# EAGLE schematic GateControl (EAGLE 6.4)
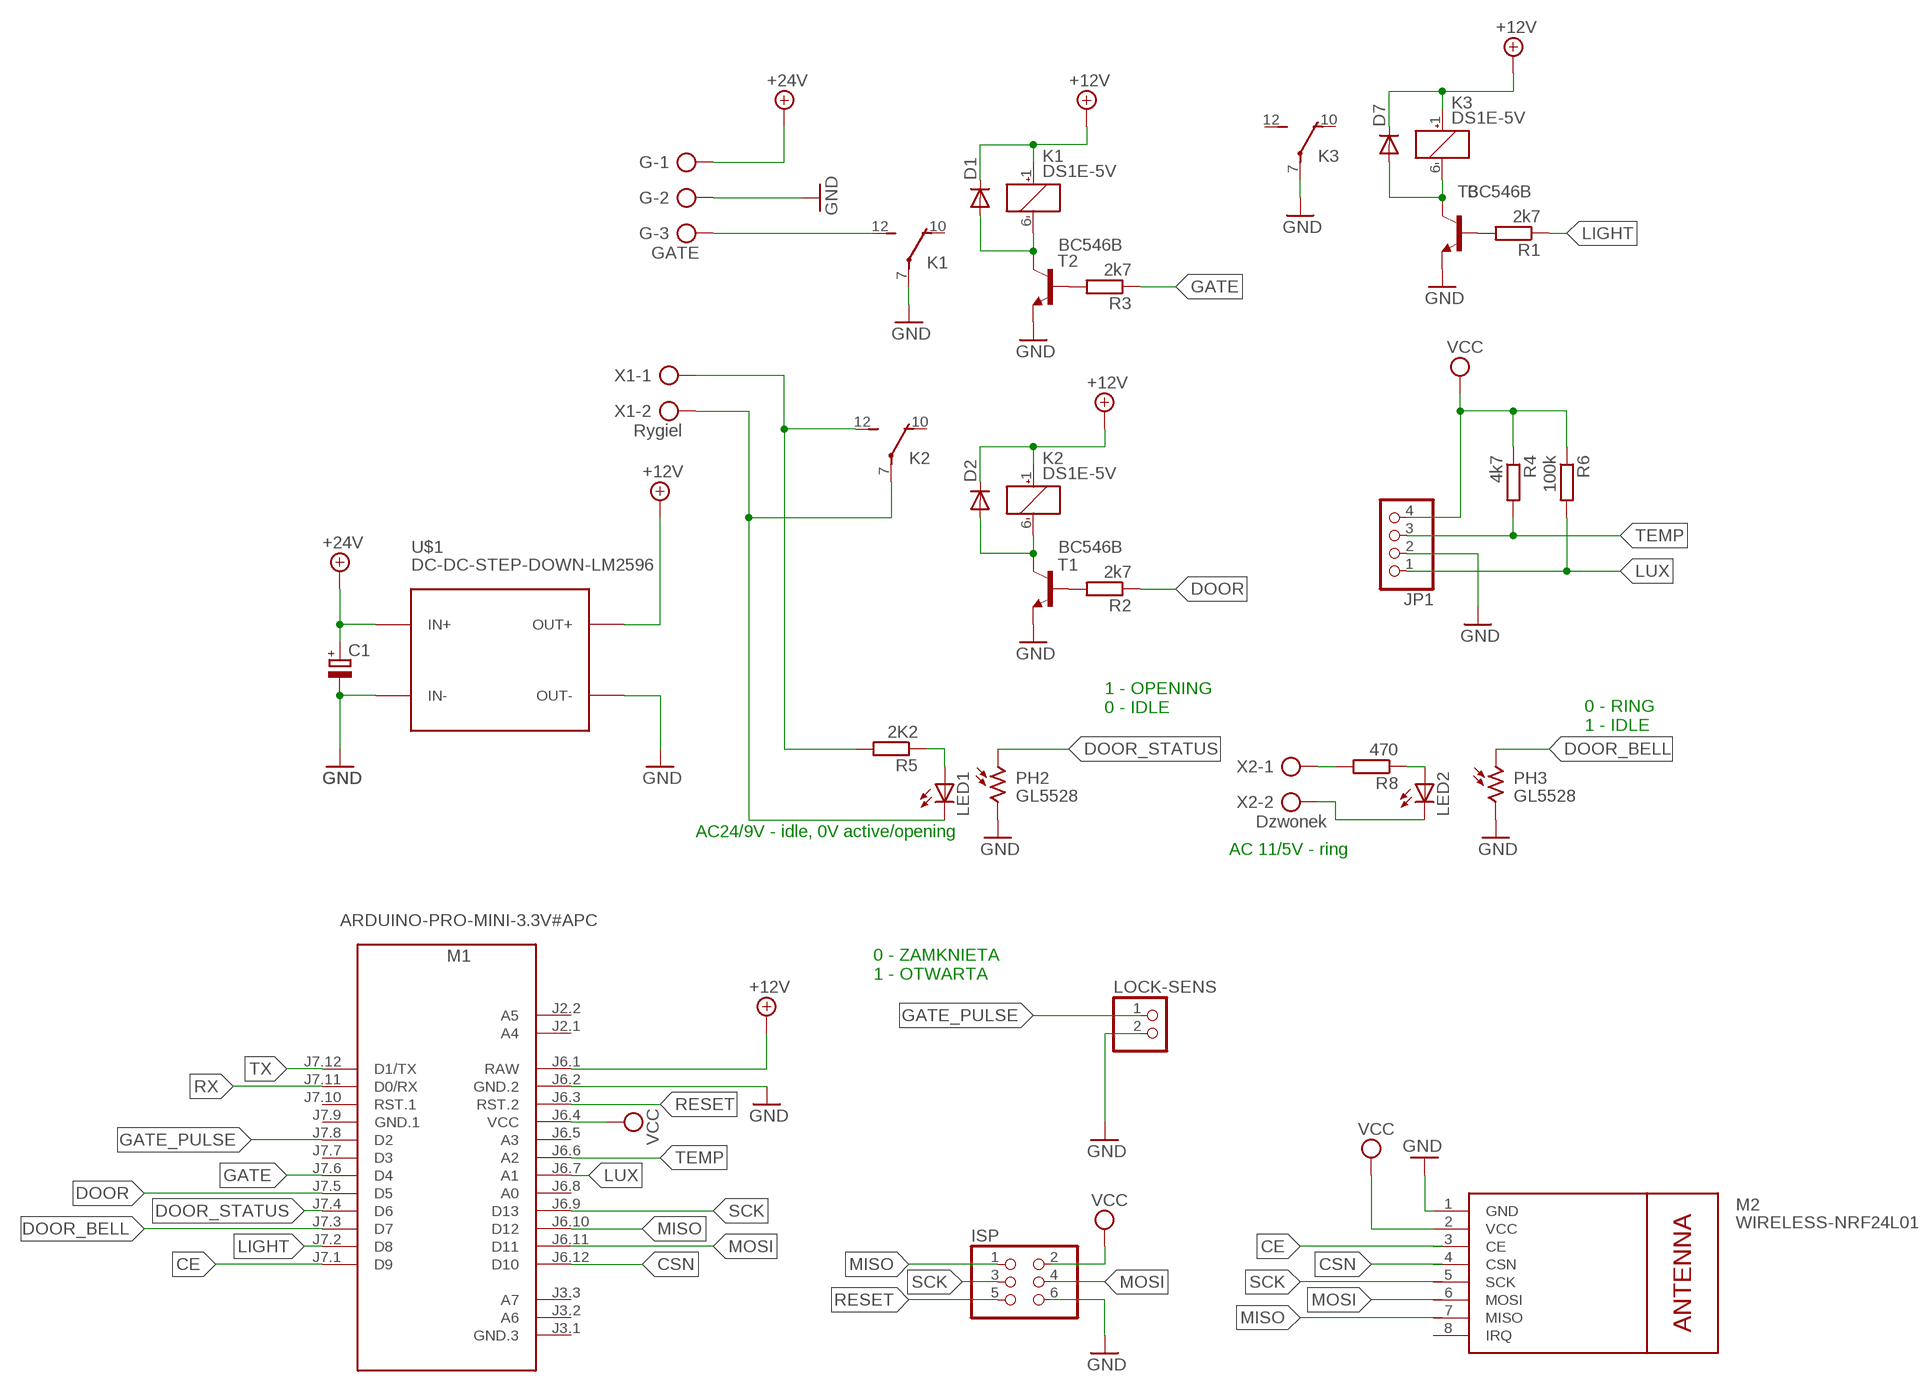
[diagram p0: schematic, sheet 1]

## Parts
C1  CPOL-EUE3.5-10  [E3,5-10]
D1  DIODE-C1702-05  [C1702-05]
D2  DIODE-C1702-05  [C1702-05]
D7  DIODE-C1702-05  [C1702-05]
G  GATE  AK500/3  [AK500/3]
ISP  PINHD-2X03_2.54  [2X03]
JP1  PINHD-1X04_2.54  [1X04]
K1  DS1E-5V  [DS1E]
K2  DS1E-5V  [DS1E]
K3  DS1E-5V  [DS1E]
LED1  LED5MM  [LED5MM]
LED2  LED5MM  [LED5MM]
LOCK-SENS  PINHD-1X02_2.54  [1X02]
M1  ARDUINO-PRO-MINI-3.3V#APC  [ARDUINO-PRO-MINI#APC]
M2  WIRELESS-NRF24L01  [WIRELESS-NRF24L01]
PH2  GL5528  VT20N1  [TO46-VT200]
PH3  GL5528  VT20N1  [TO46-VT200]
R1  2k7  R-EU_0309/V  [0309V]
R2  2k7  R-EU_0309/V  [0309V]
R3  2k7  R-EU_0309/V  [0309V]
R4  4k7  R-EU_0309/V  [0309V]
R5  2K2  R-EU_0309/V  [0309V]
R6  100k  R-EU_0309/V  [0309V]
R8  470  R-EU_0309/V  [0309V]
T1  BC546B  [TO92-EBC]
T2  BC546B  [TO92-EBC]
T3  BC546B  [TO92-EBC]
U$1  DC-DC-STEP-DOWN-LM2596  [DC-DC-STEP-DOWN-LM2596]
X1  Rygiel  AK500/2  [AK500/2]
X2  Dzwonek  AK500/2  [AK500/2]

## Nets
+12V: D1.C D2.C D7.C K1.1(1:+) K2.1(1:+) K3.1(1:+) M1.J6.1(RAW) U$1.OUT+
+24V: C1.+ G.1 U$1.IN+
CE: M1.J7.1(D9) M2.3(CE)
CSN: M1.J6.12(D10) M2.4(CSN)
DOOR: M1.J7.5(D5) R2.1
DOOR_BELL: M1.J7.3(D7) PH3.1
DOOR_STATUS: M1.J7.4(D6) PH2.1
GATE: M1.J7.6(D4) R3.1
GATE_PULSE: LOCK-SENS.1 M1.J7.8(D2)
GND: C1.- G.2 ISP.6 JP1.2 K1.7(2:P) K3.7(2:P) LOCK-SENS.2 M1.J6.2(GND.2) M2.1(GND) PH2.2 PH3.2 T1.E T2.E T3.E U$1.IN- U$1.OUT-
LIGHT: M1.J7.2(D8) R1.1
LUX: JP1.1 M1.J6.7(A1) R6.2
MISO: ISP.1 M1.J6.10(D12) M2.7(MISO)
MOSI: ISP.4 M1.J6.11(D11) M2.6(MOSI)
N$1: D7.A K3.6(1:-) T3.C
N$2: R1.2 T3.B
N$4: K2.12(2:S) R5.2 X1.1
N$5: K2.7(2:P) LED1.K(C) X1.2
N$6: R2.2 T1.B
N$7: D1.A K1.6(1:-) T2.C
N$8: D2.A K2.6(1:-) T1.C
N$9: R3.2 T2.B
N$11: LED1.A R5.1
N$12: LED2.A R8.1
N$13: LED2.K(C) X2.2
N$14: R8.2 X2.1
RESET: ISP.5 M1.J6.3(RST.2)
RX: M1.J7.11(D0/RX)
SCK: ISP.3 M1.J6.9(D13) M2.5(SCK)
TEMP: JP1.3 M1.J6.6(A2) R4.2
TX: M1.J7.12(D1/TX)
VCC: ISP.2 JP1.4 M1.J6.4(VCC) M2.2(VCC) R4.1 R6.1
VCC2: G.3 K1.12(2:S)
Unconnected: K1.10(2:O) K2.10(2:O) K3.10(2:O) K3.12(2:S) M1.J2.1(A4) M1.J2.2(A5) M1.J3.1(GND.3) M1.J3.2(A6) M1.J3.3(A7) M1.J6.5(A3) M1.J6.8(A0) M1.J7.7(D3) M1.J7.10(RST.1) M2.8(IRQ)

## Notes on the sheet
- 1 - OPENING
  0 - IDLE
- 0 - RING
  1 - IDLE
- AC24/9V - idle, 0V active/opening
- AC 11/5V - ring
- 0 - ZAMKNIETA
  1 - OTWARTA

## Power pins joined to a net without a drawn wire
GND.1: M1.J7.9(GND.1)

## Library data of the parts
C1 = rcl:CPOL-EU: POLARIZED CAPACITOR, European symbol
D1 D2 D7 = diode:DIODE-: DIODE
G = con-ptr500:AK500/3: CONNECTOR; OC_FARNELL: unknown; OC_NEWARK: unknown
ISP = pinhead-2:PINHD-2X03: PIN HEADER
JP1 = pinhead-2:PINHD-1X04: PIN HEADER
K1-K3 = relay:DS1E-*?: DS-RELAYS HIGHLY SENSITIVE 1500 V FCC SURGE NAiS WITHSTANDING MINIATURE RELAY Source: http://www.mew-europe.com/.. en_ds_61005_0001.pdf; OC_FARNELL: unknown; OC_NEWARK: unknown
LED1 LED2 = led:LED: LED OSRAM: - CHIPLED LG R971, LG N971, LY N971, LG Q971, LY Q971, LO R971, LY R971 LH N974, LH R974 LS Q976, LO Q976, LY Q976 LO Q996 - Hyper CHIPLED LW Q18S LB Q993, LB Q99A, LB R99A - SideLED LS A670, LO A670, LY A670, LG A670, LP A670 LB A673, LV A673, LT A673, LW A673 LH A674 LY A675 LS A676, LA A676, LO A676, LY A676, LW A676 LS A679, LY A679, LG A679 - Hyper Micro SIDELED® LS Y876, LA Y876, LO Y876, LY Y876 LT Y87S - SmartLED LW L88C, LW L88S LB L89C, LB L89S, LG L890 LS L89K, LO L89K, LY L89K LS L896, LA L896, LO L896, LY L896 - TOPLED LS T670, LO T670, LY T670, LG T670, LP T670 LSG T670, LSP T670, LSY T670, LOP T670, LYG T670 LG T671, LOG T671, LSG T671 LB T673, LV T673, LT T673, LW T673 LH T674 LS T676, LA T676, LO T676, LY T676, LB T676, LH T676, LSB T676, LW T676 LB T67C, LV T67C, LT T67C, LS T67K, LO T67K, LY T67K, LW E67C LS E67B, LA E67B, LO E67B, LY E67B, LB E67C, LV E67C, LT E67C LW T67C LS T679, LY T679, LG T679 LS T770, LO T770, LY T770, LG T770, LP T770 LB T773, LV T773, LT T773, LW T773 LH T774 LS E675, LA E675, LY E675, LS T675 LS T776, LA T776, LO T776, LY T776, LB T776 LHGB T686 LT T68C, LB T68C - Hyper Mini TOPLED® LB M676 - Mini TOPLED Santana® LG M470 LS M47K, LO M47K, LY M47K Source: http://www.osram.convergy.de LUXEON: - LUMILED® LXK2-PW12-R00, LXK2-PW12-S00, LXK2-PW14-U00, LXK2-PW14-V00 LXK2-PM12-R00, LXK2-PM12-S00, LXK2-PM14-U00 LXK2-PE12-Q00, LXK2-PE12-R00, LXK2-PE12-S00, LXK2-PE14-T00, LXK2-PE14-U00 LXK2-PB12-K00, LXK2-PB12-L00, LXK2-PB12-M00, LXK2-PB14-N00, LXK2-PB14-P00, LXK2-PB14-Q00 LXK2-PR12-L00, LXK2-PR12-M00, LXK2-PR14-Q00, LXK2-PR14-R00 LXK2-PD12-Q00, LXK2-PD12-R00, LXK2-PD12-S00 LXK2-PH12-R00, LXK2-PH12-S00 LXK2-PL12-P00, LXK2-PL12-Q00, LXK2-PL12-R00 Source: www.luxeon.com KINGBRIGHT: KA-3528ASYC Source: www.kingbright.com
LOCK-SENS = pinhead-2:PINHD-1X02: PIN HEADER
M1 = diy-modules:ARDUINO-PRO-MINI-*#APC: Arduino Pro Mini with angle programming connector
M2 = diy-modules:WIRELESS-NRF24L01: 2.4 GHz Wireless Module based on NRF24L01 chip
PH2 PH3 = photo-elements:VT2*: Photoconductive Cell VT200 Series Source: http://optoelectronics.perkinelmer.com/content/Datasheets/DTS_vt200seriesdatasheet.pdf
R1-R6 R8 = rcl:R-EU_: RESISTOR, European symbol
T1-T3 = transistor-npn:BC546*: NPN Transistor
U$1 = diy-modules:DC-DC-STEP-DOWN-LM2596: DC/DC Step-Down Regulator based on LM2596-ADJ chip
X1 X2 = con-ptr500:AK500/2: CONNECTOR; OC_FARNELL: unknown; OC_NEWARK: unknown